# Altium project LM2576 Buck Converter.PrjPcb
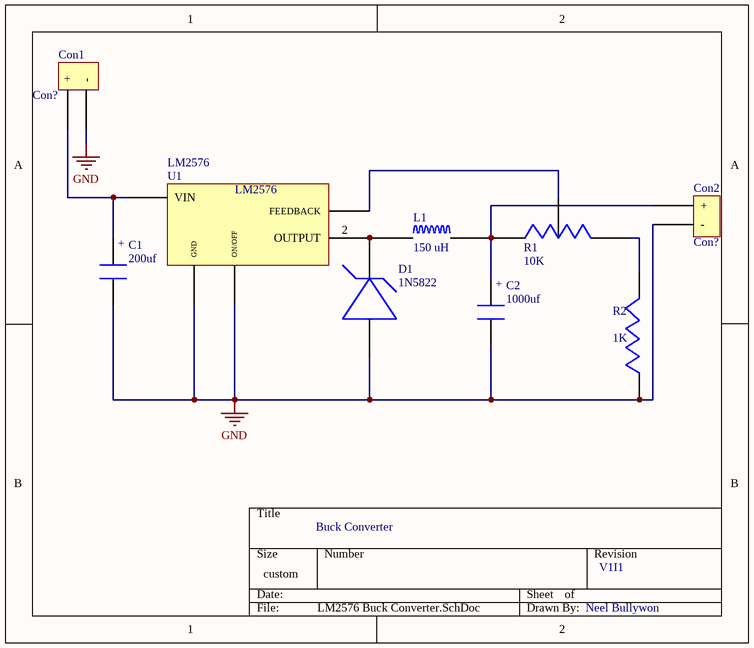
[diagram p0: LM2576 Buck Converter.SchDoc]
1 sheet, 9 parts. Net scope: global (net labels, ports and power ports of the same name join across sheets).
Board file: LM2576 Buck Converter.PcbDoc

## Sheet LM2576 Buck Converter.SchDoc
size 139 x 119 mm; SheetNumber: 1; SheetTotal: 1

### Parts
C1  200uf  [220uF Capacitor]
C2  1000uf  [1000Uf Cap]
Con1  Con?  [2pin]
Con2  Con?  [2pin]
D1  1N5822  [1n5822]
L1  150 uH  [150uH Inductor]
R1  10K  [10K Pot]
R2  1K  [1K 1206 Res]
U1  LM2576  [LM2576-TO63-5]

### Nets
GND: C1.2 C2.2 Con1.2(-) Con2.2(-) D1.2 R2.1 U1.3(GND) U1.5(ON/OFF)
NetC1_1: C1.1 Con1.1(+) U1.1(VIN)
NetC2_1: C2.1 Con2.1(+) L1.2
NetD1_1: D1.1 L1.1 U1.2(OUTPUT)
NetR1_2: R1.2 U1.4(FEEDBACK)
NetR1_3: R1.3 R2.2

Not connected (* = marked no-connect by the designer): R1 1

### Notes on the sheet
- Buck Converter
- V1I1
- Neel Bullywon
- (in symbol Electrolytic Capacitor) +

### Library data of the parts
C1 C2 = Electrolytic Capacitor
Con1 Con2 = 2PinConnector
L1 = 150UH L
R1 = Variable Resistor
R2 = Resistor